# Altium project HAB_V01R01.PrjPCB
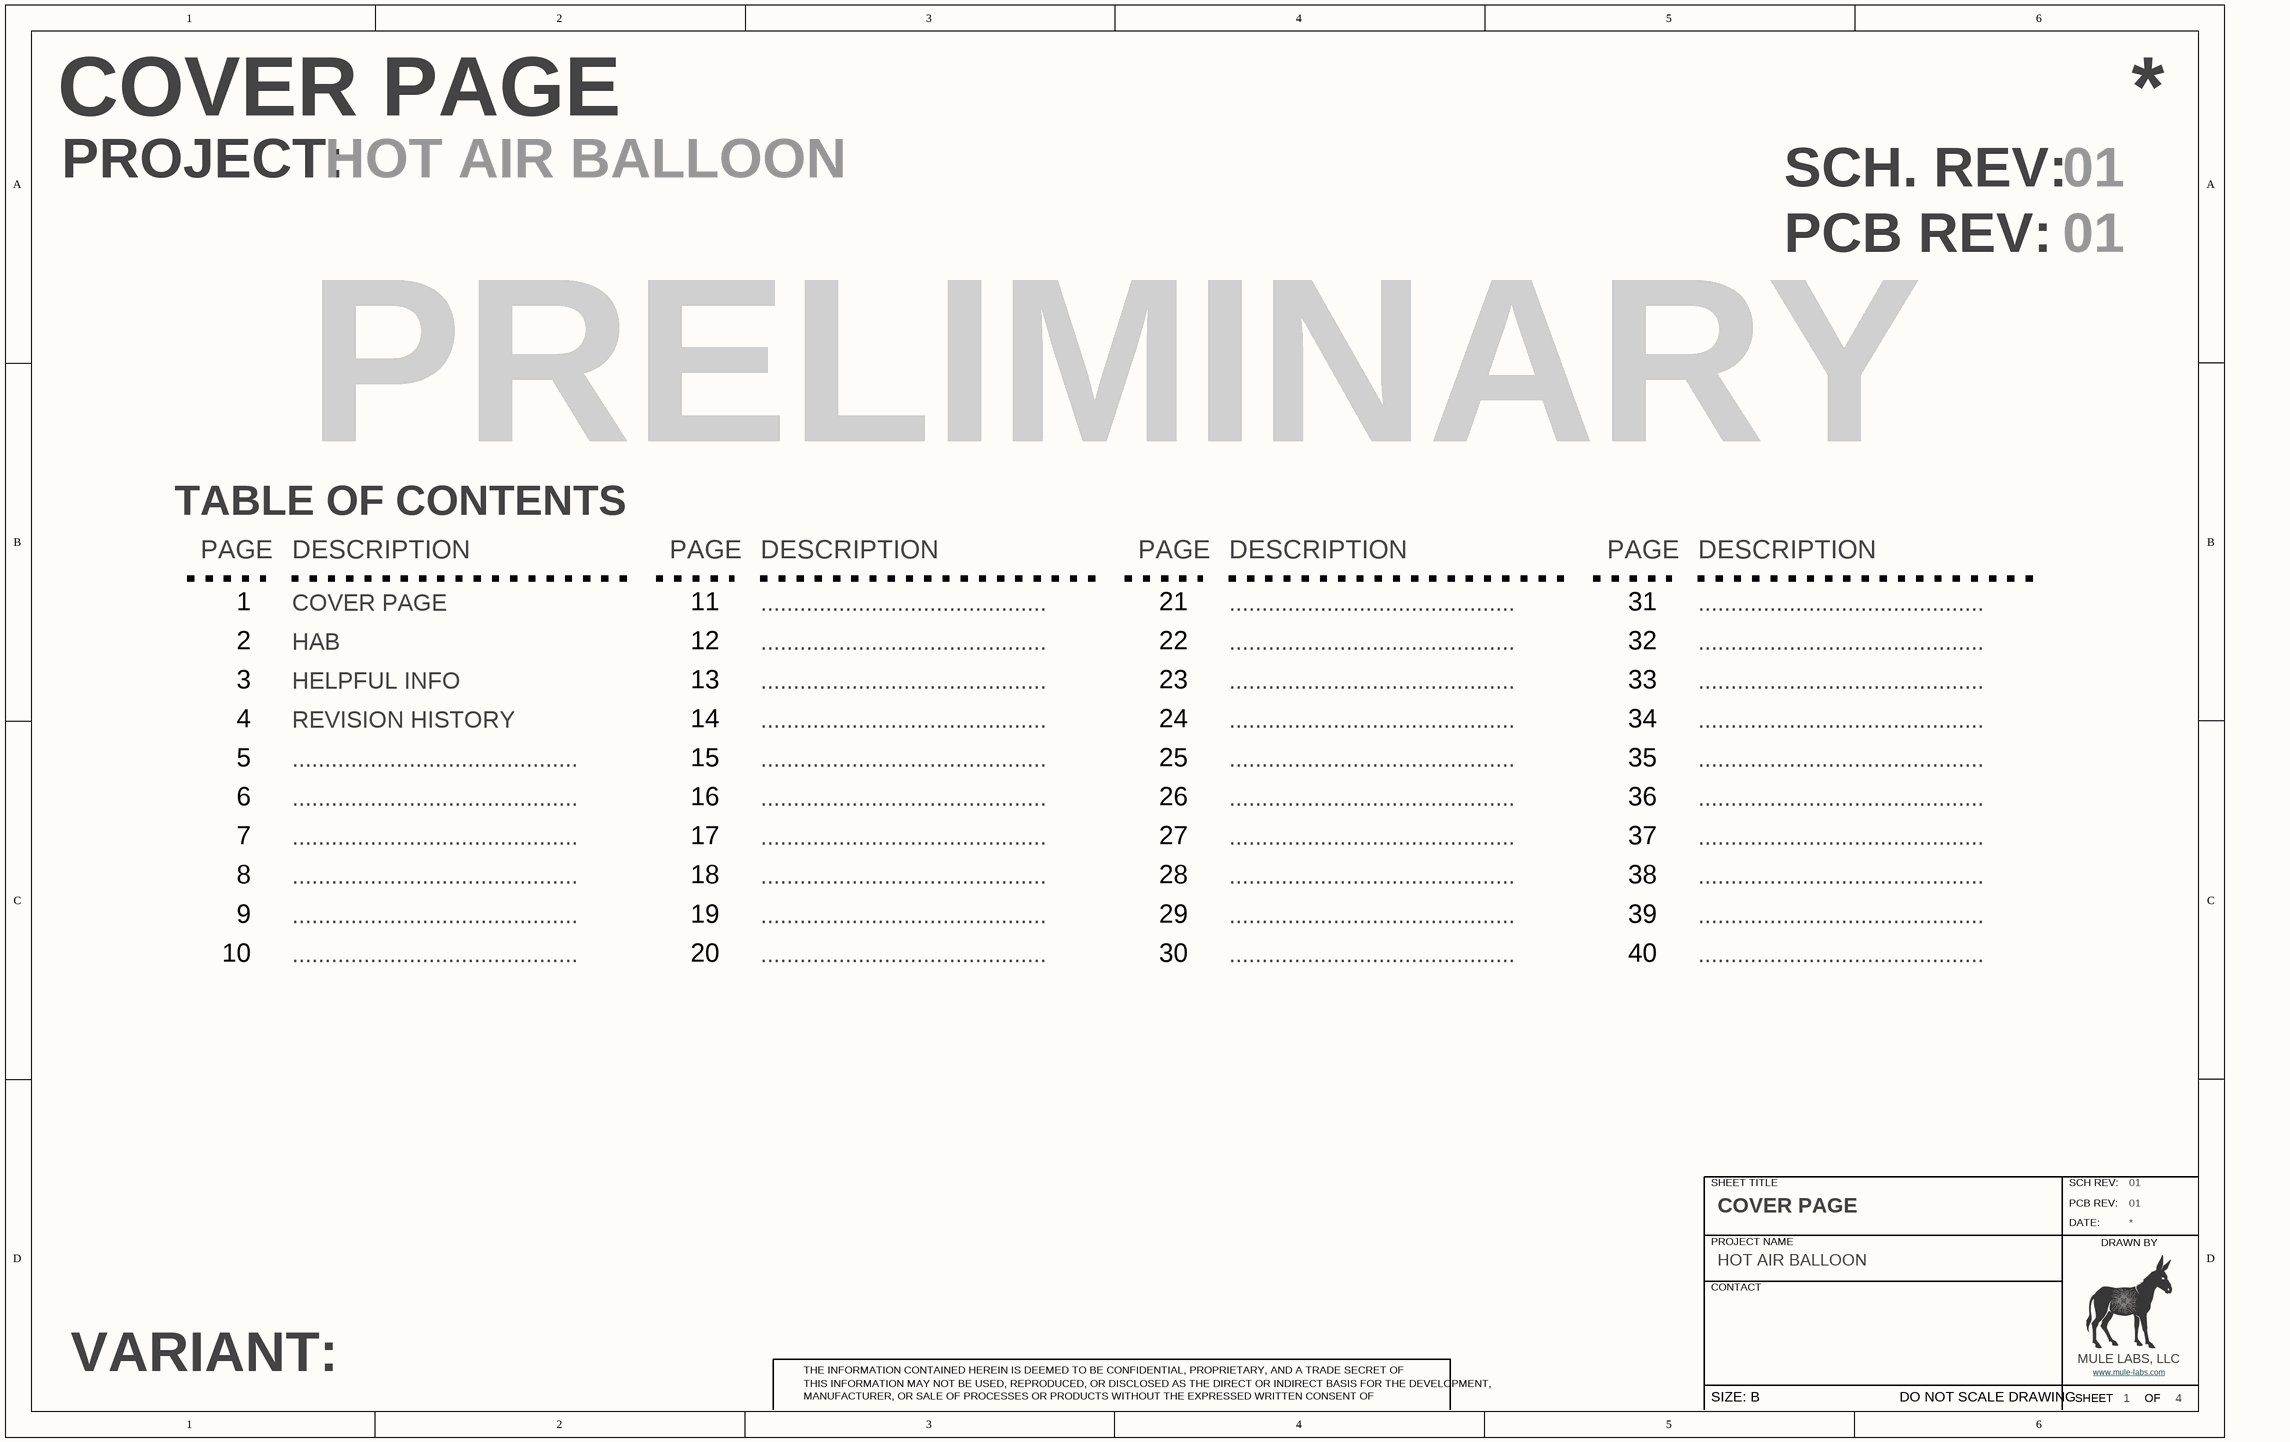
[diagram p0: [01] - COVER PAGE.SchDoc]
4 sheets, 7 parts. Net scope: global (net labels, ports and power ports of the same name join across sheets).
Board file: HAB_V01R01.PcbDoc
Sheets:
  [01] - COVER PAGE.SchDoc
  [02] - HAB.SchDoc
  [03] - HELPFUL INFO.SchDoc
  [04] - REVISION HISTORY.SchDoc

## Sheet [01] - COVER PAGE.SchDoc: COVER PAGE
size 433 x 279 mm; Author: ZAG; DrawnBy: ZAG; SheetNumber: 1; SheetTotal: 4; PageSetup: Record=PageOptions|CenterHorizontal=True|CenterVertical=True|PrintScale=0.96|XCorrection=1.00|YCorrection=1.00|PrintKind=2|BorderSize=5000000|LeftOffset=0|BottomOffset=0|Orientation=2|PaperLength=4318|PaperWidth=2794|Scale=100|PaperSource=15|PrintQuality=600|MediaType=1|DitherType=10|PaperKind=11x17|PrintScaleMode=1; SchRevision: 01; PCBRevision: 01; Project: HOT AIR BALLOON; SchStatus: PRELIMINARY

### Notes on the sheet
- PROJECT:
- SCH. REV:
- PCB REV:
- TABLE OF CONTENTS
- PAGE
- 1
- DESCRIPTION
- COVER PAGE
- 11
- ............................................
- 21
- 31
- 2
- HAB
- 12
- 22
- 32
- 3
- 4
- REVISION HISTORY
- HELPFUL INFO
- 13
- 14
- 23
- 24
- 33
- 34
- 5
- 6
- 15
- 16
- 25
- 26
- 35
- 36
- 7
- 17
- 27
- 37
- 8
- 9
- 18
- 19
- 28
- 29
- 38
- 39
- 10
- 20
- 30
- 40
- VARIANT:
- SHEET TITLE
- SCH REV:
- PROJECT NAME
- DATE:
- DRAWN BY
- CONTACT
- MANUFACTURER, OR SALE OF PROCESSES OR PRODUCTS WITHOUT THE EXPRESSED WRITTEN CONSENT OF
- THE INFORMATION CONTAINED HEREIN IS DEEMED TO BE CONFIDENTIAL, PROPRIETARY, AND A TRADE SECRET OF
- THIS INFORMATION MAY NOT BE USED, REPRODUCED, OR DISCLOSED AS THE DIRECT OR INDIRECT BASIS FOR THE DEVELOPMENT,
- SHEET
- MULE LABS, LLC
- www.mule-labs.com <http://www.mule-labs.com>
- OF
- SIZE: B
- DO NOT SCALE DRAWING

## Sheet [02] - HAB.SchDoc: HAB
size 433 x 279 mm; Author: ZAG; DrawnBy: ZAG; SheetNumber: 2; SheetTotal: 4; PageSetup: Record=PageOptions|CenterHorizontal=True|CenterVertical=True|PrintScale=0.96|XCorrection=1.00|YCorrection=1.00|PrintKind=2|BorderSize=5000000|LeftOffset=0|BottomOffset=0|Orientation=2|PaperLength=4318|PaperWidth=2794|Scale=100|PaperSource=15|PrintQuality=600|MediaType=1|DitherType=10|PaperKind=11x17|PrintScaleMode=1; SchRevision: 01; PCBRevision: 01; Project: HIGH ALTITUDE BALLOON; SchStatus: PRELIMINARY
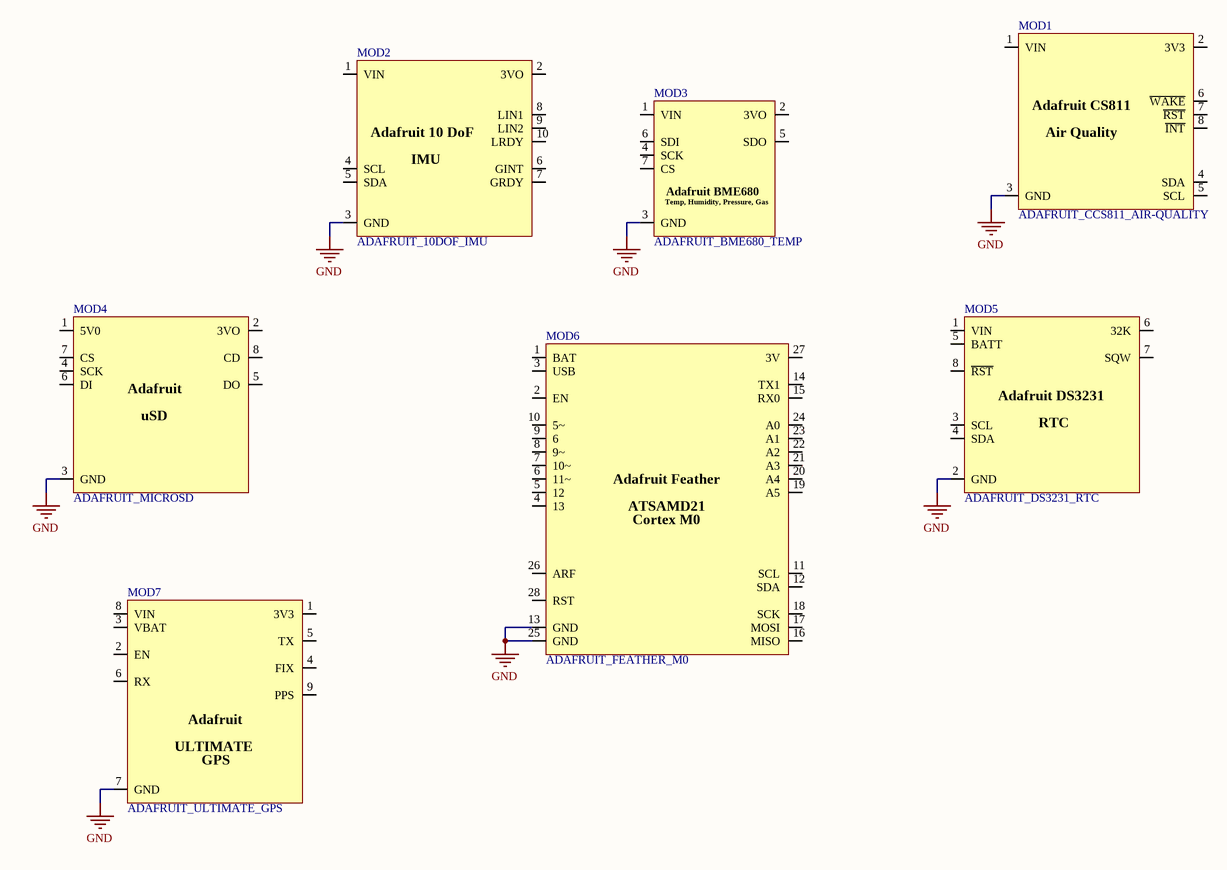
[diagram p1: [02] - HAB.SchDoc]

### Parts
MOD1  ADAFRUIT_CCS811_AIR-QUALITY  [ADAFRUIT_CCS811_AIR-QUALITY]
MOD2  ADAFRUIT_10DOF_IMU  [ADAFRUIT_10DOF_IMU]
MOD3  ADAFRUIT_BME680_TEMP  [ADAFRUIT_BME680_TEMP]
MOD4  ADAFRUIT_MICROSD  [ADAFRUIT_MicroSD]
MOD5  ADAFRUIT_DS3231_RTC  [ADAFRUIT_DS3231_RTC]
MOD6  ADAFRUIT_FEATHER_M0  [ADAFRUIT_FEATHER_M0]
MOD7  ADAFRUIT_ULTIMATE_GPS  [ADAFRUIT_ULTIMATE_GPS]

### Nets
GND: MOD1.3(GND) MOD2.3(GND) MOD3.3(GND) MOD4.3(GND) MOD5.2(GND) MOD6.13(GND) MOD6.25(GND) MOD7.7(GND)

Not connected (* = marked no-connect by the designer): MOD1 1(VIN) 2(3V3) 4(SDA) 5(SCL) 6(~{WAKE}) 7(~{RST}) 8(~{INT}); MOD2 1(VIN) 2(3VO) 4(SCL) 5(SDA) 6(GINT) 7(GRDY) 8(LIN1) 9(LIN2) 10(LRDY); MOD3 1(VIN) 2(3VO) 4(SCK) 5(SDO) 6(SDI) 7(CS); MOD4 1(5V0) 2(3VO) 4(SCK) 5(DO) 6(DI) 7(CS) 8(CD); MOD5 1(VIN) 3(SCL) 4(SDA) 5(BATT) 6(32K) 7(SQW) 8(~{RST}); MOD6 1(BAT) 2(EN) 3(USB) 4(13) 5(12) 6(11~) 7(10~) 8(9~) 9(6) 10(5~) 11(SCL) 12(SDA) 14(TX1) 15(RX0) 16(MISO) 17(MOSI) 18(SCK) 19(A5) 20(A4) 21(A3) 22(A2) 23(A1) 24(A0) 26(ARF) 27(3V) 28(RST); MOD7 1(3V3) 2(EN) 3(VBAT) 4(FIX) 5(TX) 6(RX) 8(VIN) 9(PPS)

### Notes on the sheet
- SHEET TITLE
- SCH REV:
- PROJECT NAME
- PCB REV:
- DATE:
- DRAWN BY
- CONTACT
- MANUFACTURER, OR SALE OF PROCESSES OR PRODUCTS WITHOUT THE EXPRESSED WRITTEN CONSENT OF
- THE INFORMATION CONTAINED HEREIN IS DEEMED TO BE CONFIDENTIAL, PROPRIETARY, AND A TRADE SECRET OF
- THIS INFORMATION MAY NOT BE USED, REPRODUCED, OR DISCLOSED AS THE DIRECT OR INDIRECT BASIS FOR THE DEVELOPMENT,
- SHEET
- MULE LABS, LLC
- www.mule-labs.com <http://www.mule-labs.com>
- OF
- SIZE: B
- DO NOT SCALE DRAWING
- (in symbol ADAFRUIT_10DOF_IMU) Adafruit 10 DoF; IMU
- (in symbol ADAFRUIT_BME680_TEMP) Adafruit BME680; Temp, Humidity, Pressure, Gas
- (in symbol ADAFRUIT_CCS811_AIR-QUALITY) Adafruit CS811; Air Quality
- (in symbol ADAFRUIT_DS3231_RTC) Adafruit DS3231; RTC
- (in symbol ADAFRUIT_FEATHER_M0) Adafruit Feather; ATSAMD21; Cortex M0
- (in symbol ADAFRUIT_MICROSD) Adafruit; uSD
- (in symbol ADAFRUIT_ULTIMATE_GPS) Adafruit; ULTIMATE; GPS

## Sheet [03] - HELPFUL INFO.SchDoc: HELPFUL INFO
size 433 x 279 mm; Author: ZAG; DrawnBy: ZAG; SheetNumber: 3; SheetTotal: 4; PageSetup: Record=PageOptions|CenterHorizontal=True|CenterVertical=True|PrintScale=0.96|XCorrection=1.00|YCorrection=1.00|PrintKind=2|BorderSize=5000000|LeftOffset=0|BottomOffset=0|Orientation=2|PaperLength=4318|PaperWidth=2794|Scale=100|PaperSource=15|PrintQuality=600|MediaType=1|DitherType=10|PaperKind=11x17|PrintScaleMode=1; PCBRevision: 01; SchRevision: 01; Project: HOT AIR BALLOON; SchStatus: PRELIMINARY
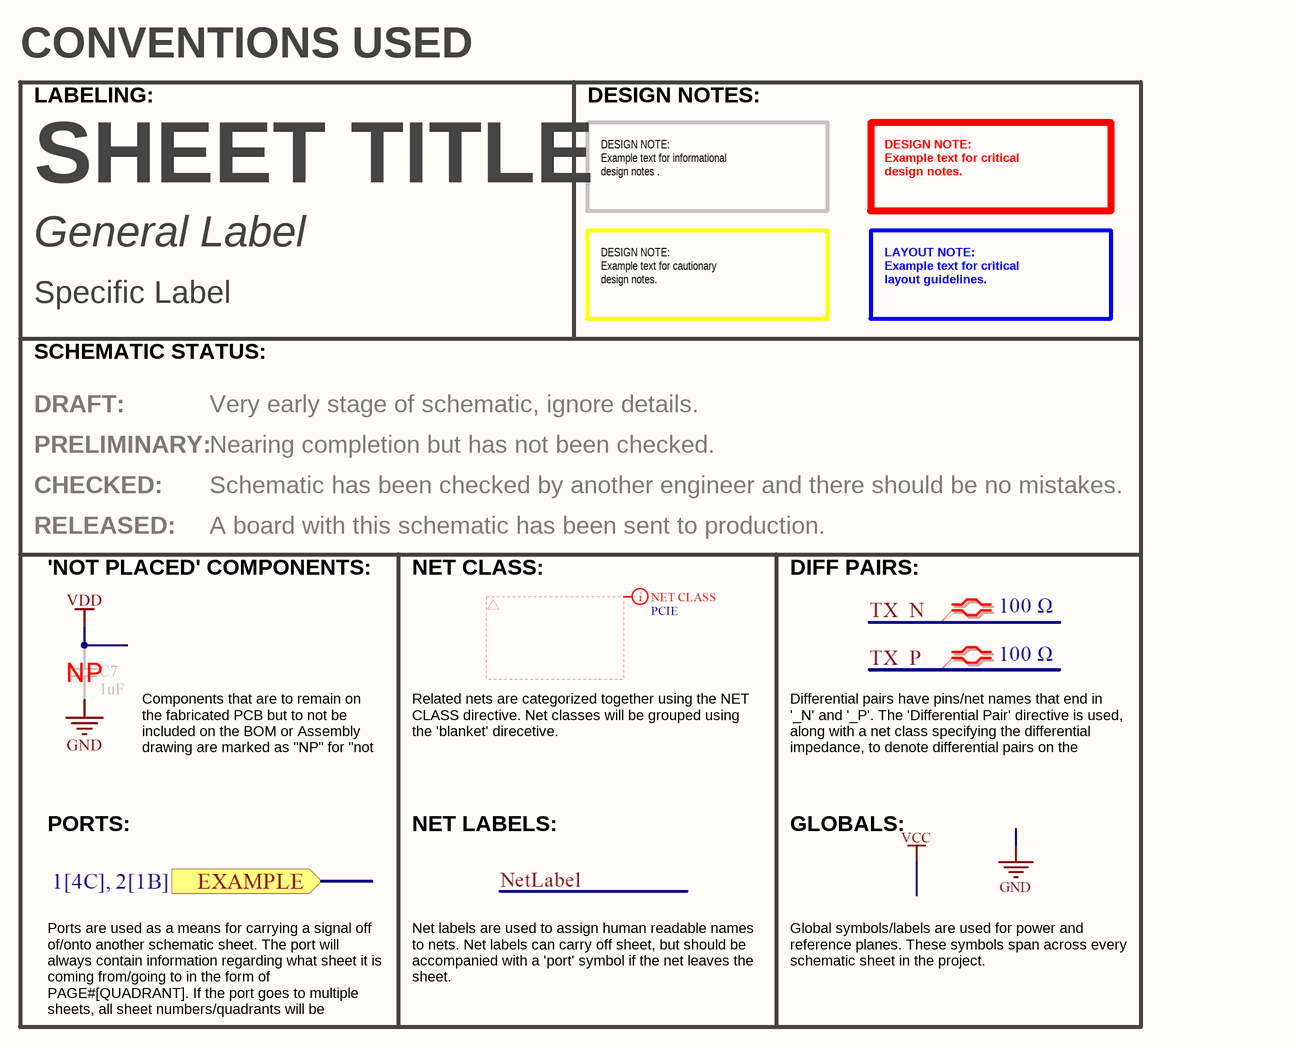
[diagram p2: [03] - HELPFUL INFO.SchDoc]

### Notes on the sheet
- CONVENTIONS USED
- LABELING:
- DESIGN NOTES:
- SHEET TITLE
- DESIGN NOTE:
  Example text for informational
  design notes .
- DESIGN NOTE:
  Example text for critical
  design notes.
- General Label
- Specific Label
- DESIGN NOTE:
  Example text for cautionary
  design notes.
- LAYOUT NOTE:
  Example text for critical
  layout guidelines.
- SCHEMATIC STATUS:
- PRELIMINARY:
- DRAFT:
- Very early stage of schematic, ignore details.
- Nearing completion but has not been checked.
- RELEASED:
- CHECKED:
- Schematic has been checked by another engineer and there should be no mistakes.
- A board with this schematic has been sent to production.
- 'NOT PLACED' COMPONENTS:
- NET CLASS:
- DIFF PAIRS:
- Related nets are categorized together using the NET CLASS directive. Net classes will be grouped using the 'blanket' direcetive.
- Components that are to remain on the fabricated PCB but to not be included on the BOM or Assembly drawing are marked as "NP" for "not placed".
- Differential pairs have pins/net names that end in '_N' and '_P'. The 'Differential Pair' directive is used, along with a net class specifying the differential impedance, to denote differential pairs on the schematic.
- PORTS:
- NET LABELS:
- GLOBALS:
- Ports are used as a means for carrying a signal off of/onto another schematic sheet. The port will always contain information regarding what sheet it is coming from/going to in the form of PAGE#[QUADRANT]. If the port goes to multiple sheets, all sheet numbers/quadrants will be displayed next to the port.
- Net labels are used to assign human readable names to nets. Net labels can carry off sheet, but should be accompanied with a 'port' symbol if the net leaves the sheet.
- Global symbols/labels are used for power and reference planes. These symbols span across every schematic sheet in the project.
- SCH REV:
- PROJECT NAME
- PCB REV:
- DATE:
- DRAWN BY
- CONTACT
- MANUFACTURER, OR SALE OF PROCESSES OR PRODUCTS WITHOUT THE EXPRESSED WRITTEN CONSENT OF
- THE INFORMATION CONTAINED HEREIN IS DEEMED TO BE CONFIDENTIAL, PROPRIETARY, AND A TRADE SECRET OF
- THIS INFORMATION MAY NOT BE USED, REPRODUCED, OR DISCLOSED AS THE DIRECT OR INDIRECT BASIS FOR THE DEVELOPMENT,
- SHEET
- MULE LABS, LLC
- www.mule-labs.com <http://www.mule-labs.com>
- OF
- SIZE: B
- DO NOT SCALE DRAWING

## Sheet [04] - REVISION HISTORY.SchDoc: REVISION HISTORY
size 433 x 279 mm; Author: ZAG; DrawnBy: ZAG; SheetNumber: 4; SheetTotal: 4; PageSetup: Record=PageOptions|CenterHorizontal=True|CenterVertical=True|PrintScale=0.96|XCorrection=1.00|YCorrection=1.00|PrintKind=2|BorderSize=5000000|LeftOffset=0|BottomOffset=0|Orientation=2|PaperLength=4318|PaperWidth=2794|Scale=100|PaperSource=15|PrintQuality=600|MediaType=1|DitherType=10|PaperKind=11x17|PrintScaleMode=1; SchRevision: 01; PCBRevision: 01; Project: HOT AIR BALLOON; SchStatus: PRELIMINARY
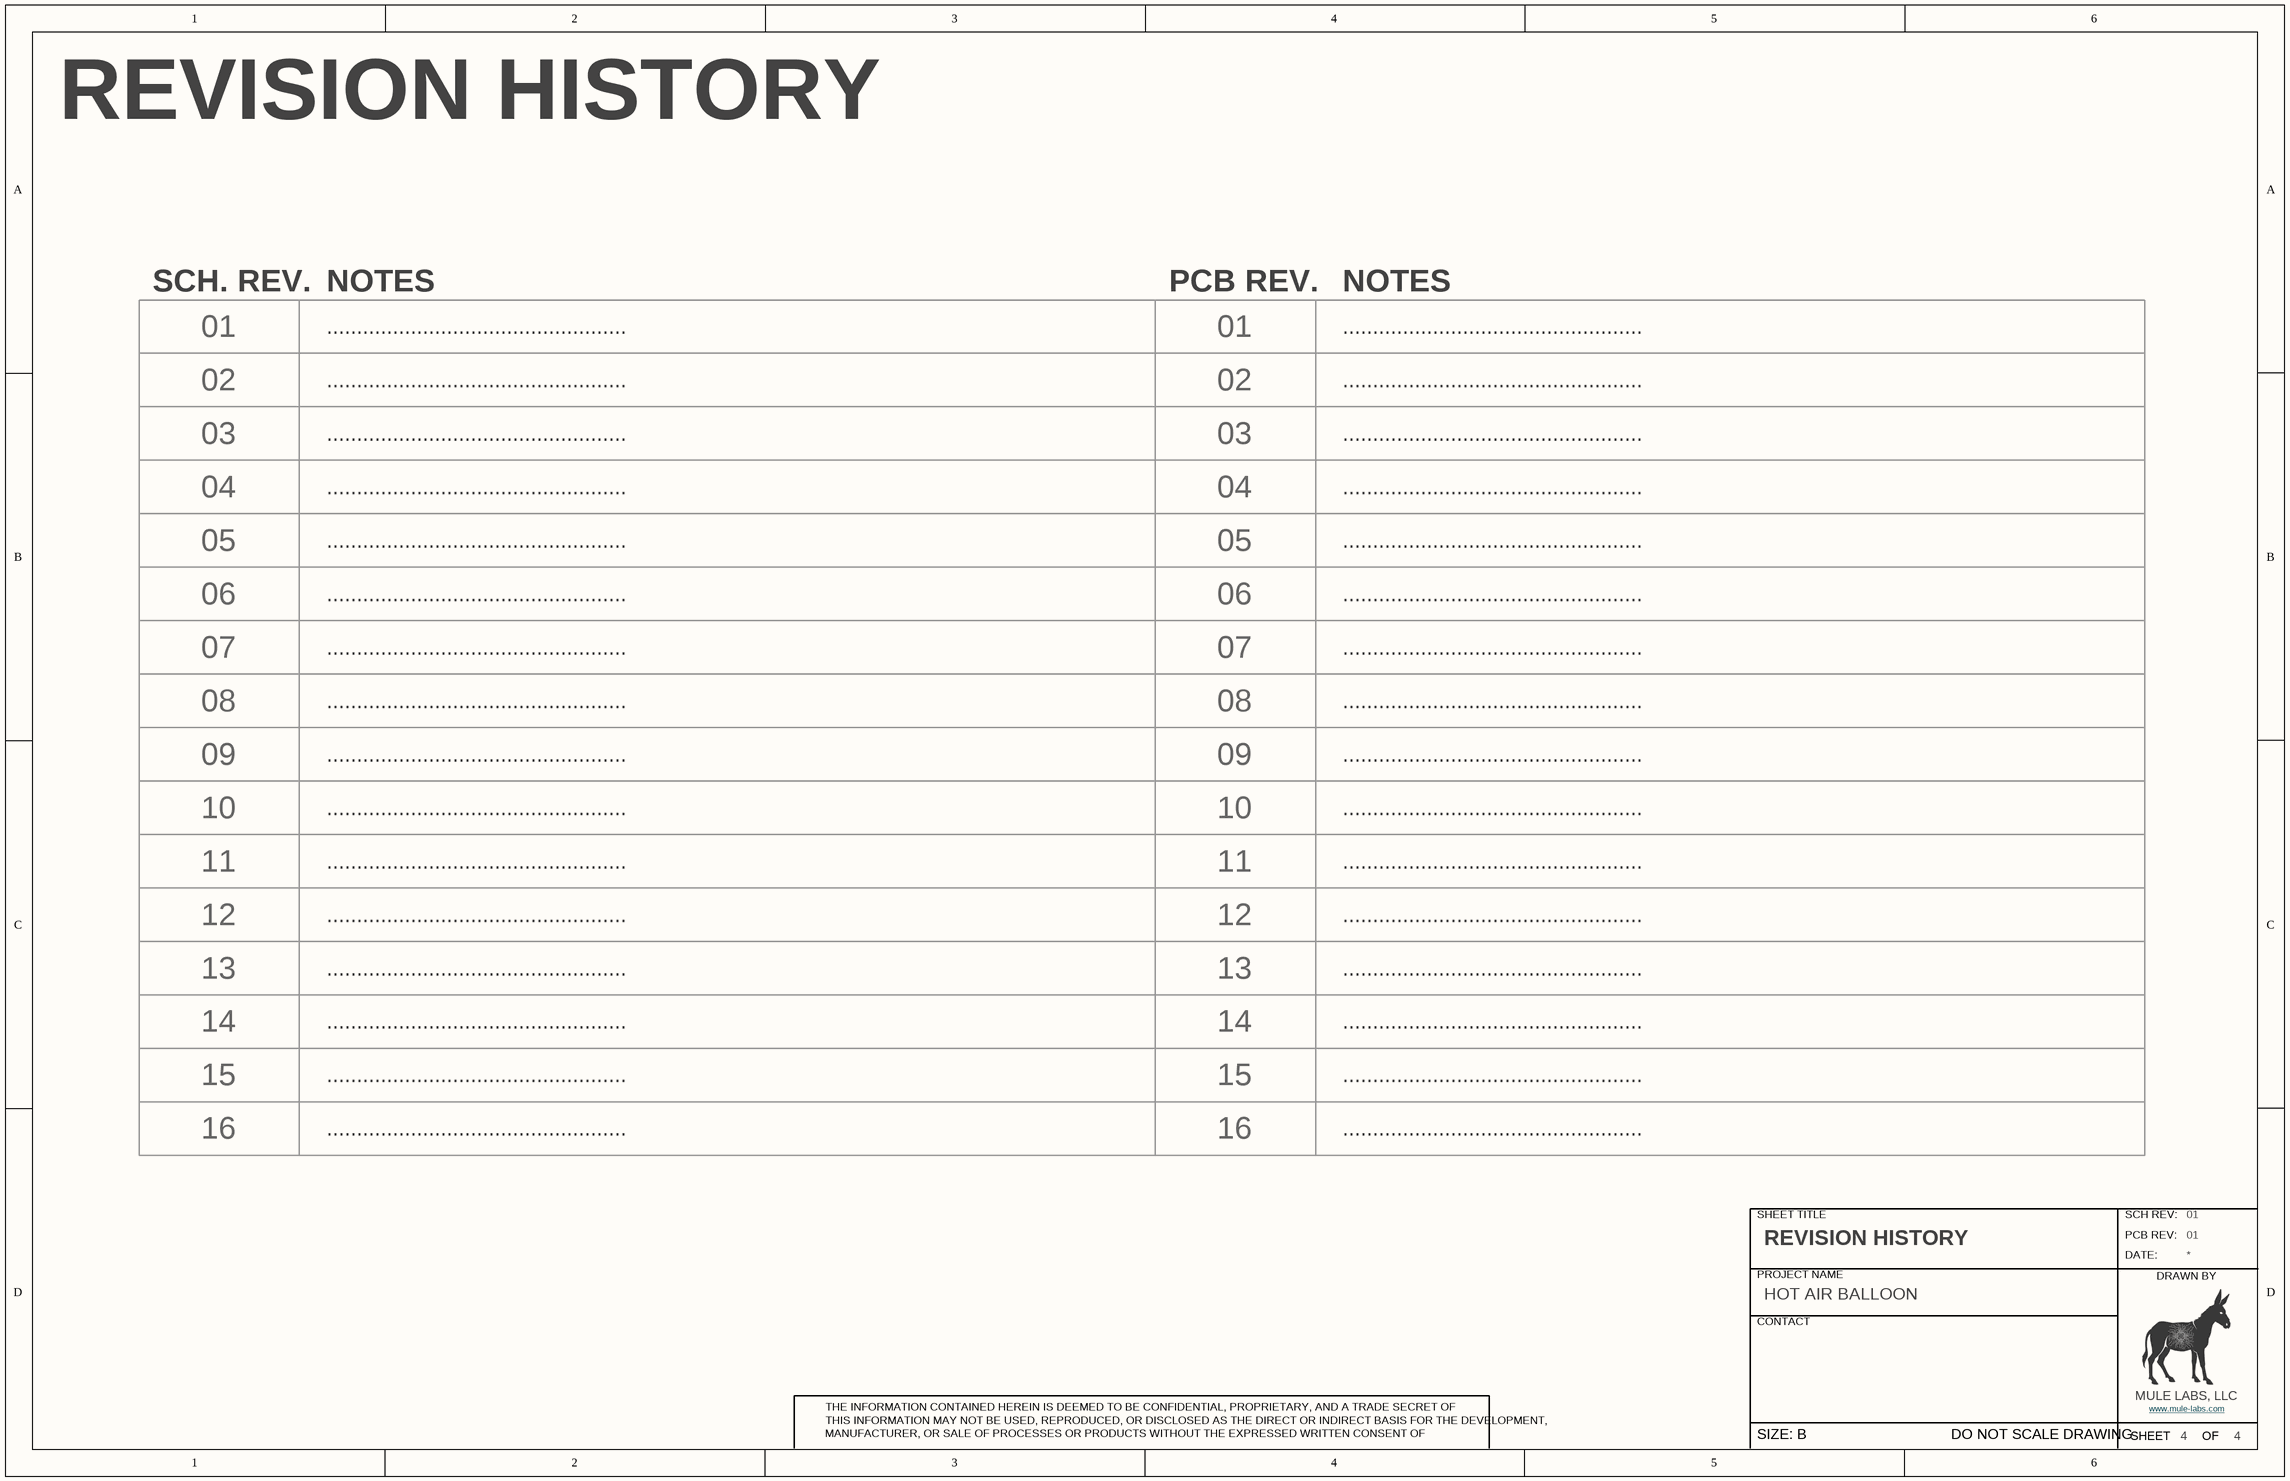
[diagram p3: [04] - REVISION HISTORY.SchDoc]

### Notes on the sheet
- SCH. REV.
- NOTES
- PCB REV.
- 01
- ..................................................
- 02
- 03
- 04
- 05
- 06
- 07
- 08
- 09
- 10
- 11
- 12
- 13
- 14
- 15
- 16
- SHEET TITLE
- SCH REV:
- PROJECT NAME
- PCB REV:
- DATE:
- DRAWN BY
- CONTACT
- MANUFACTURER, OR SALE OF PROCESSES OR PRODUCTS WITHOUT THE EXPRESSED WRITTEN CONSENT OF
- THE INFORMATION CONTAINED HEREIN IS DEEMED TO BE CONFIDENTIAL, PROPRIETARY, AND A TRADE SECRET OF
- THIS INFORMATION MAY NOT BE USED, REPRODUCED, OR DISCLOSED AS THE DIRECT OR INDIRECT BASIS FOR THE DEVELOPMENT,
- SHEET
- MULE LABS, LLC
- www.mule-labs.com <http://www.mule-labs.com>
- OF
- SIZE: B
- DO NOT SCALE DRAWING

## Assembly variants
ORIGINAL: not fitted Q2 R36 R36 R37 R58 R60 R62 R95 R96 R97 R?